# Altium schematic sheet power.SchDoc
size A4
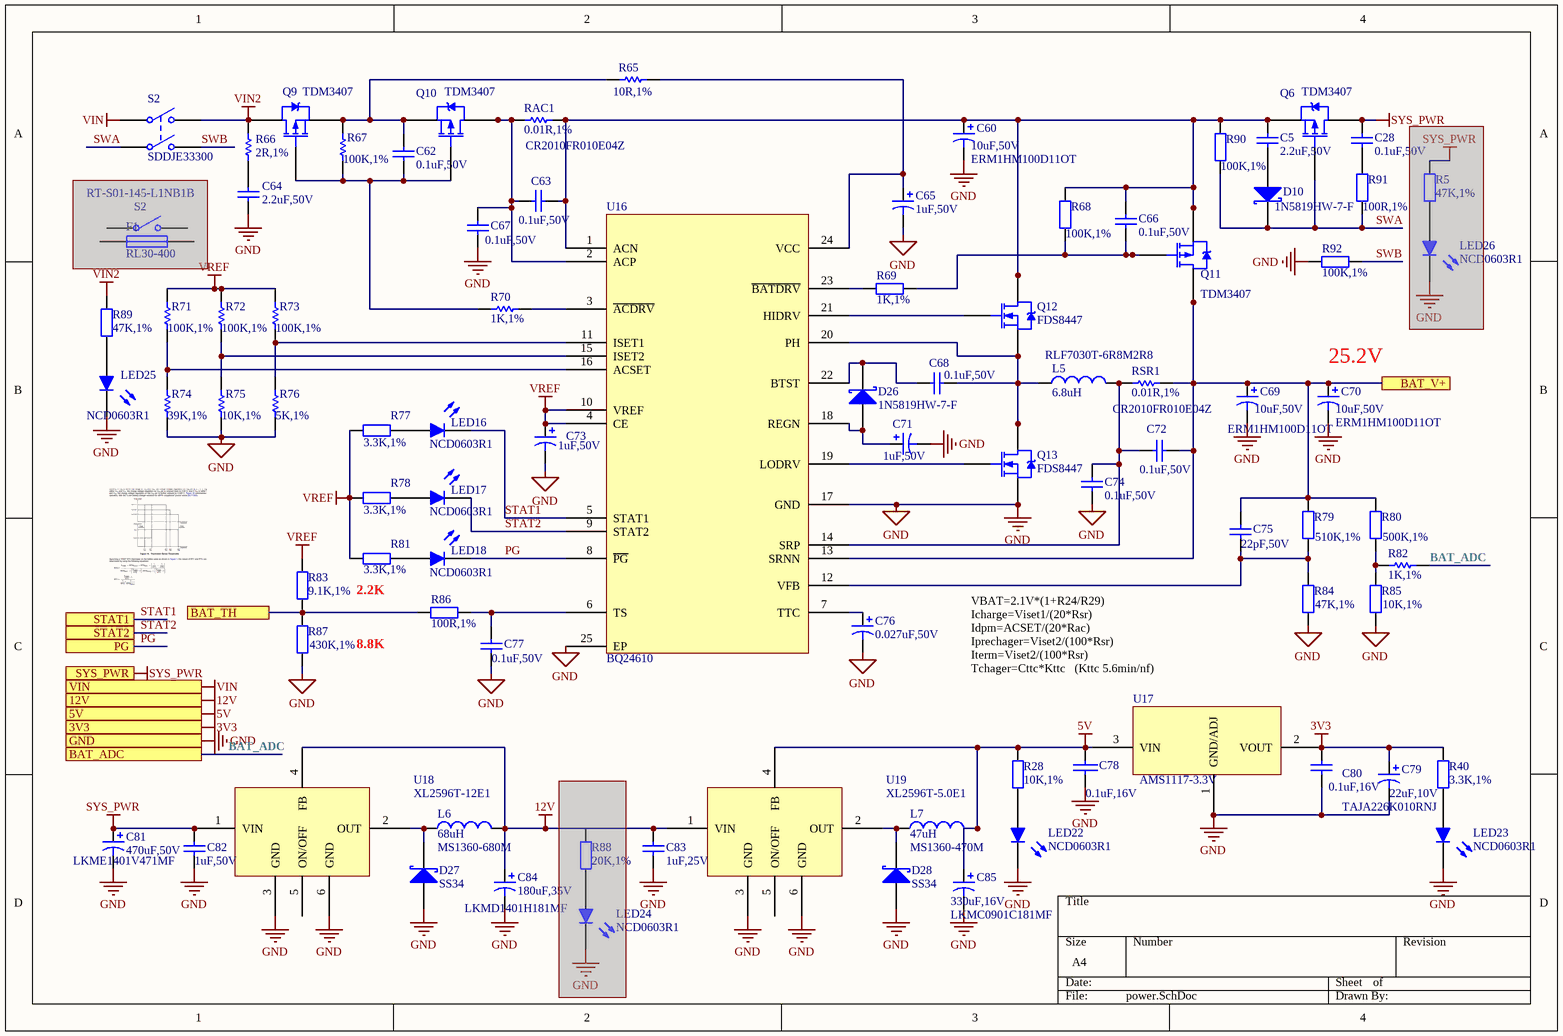
[diagram p0: power.SchDoc]

## Parts
(Parts that share a designator on the sheet are numbered #1, #2 ... from top to bottom, then left to right.)
C5  2.2uF,50V  [C0805]
C28  0.1uF,50V  [C0603]
C60  10uF,50V  value ERM1HM100D11OT  [CAP-TH_BD5.0-P2.00-D0.8-FD]
C62  0.1uF,50V  [C0603]
C63  0.1uF,50V  [C0603]
C64  2.2uF,50V  [C1206]
C65  1uF,50V  [C0603]
C66  0.1uF,50V  [C0603]
C67  0.1uF,50V  [C0603]
C68  0.1uF,50V  [C0603]
C69  10uF,50V  value ERM1HM100D11OT  [CAP-TH_BD5.0-P2.00-D0.8-FD]
C70  10uF,50V  value ERM1HM100D11OT  [CAP-TH_BD5.0-P2.00-D0.8-FD]
C71  1uF,50V  [C0603]
C72  0.1uF,50V  [C0603]
C73  1uF,50V  [C0603]
C74  0.1uF,50V  [C0603]
C75  22pF,50V  [C0603]
C76  0.027uF,50V  [C0603]
C77  0.1uF,50V  [C0603]
C78  0.1uF,16V  [C0603]
C79  22uF,10V  value TAJA226K010RNJ  [CAP-SMD_L3.2-W1.6-R-RD]
C80  0.1uF,16V  [C0603]
C81  470uF,50V  value LKME1401V471MF  [CAP-TH_BD10.0-P5.00-D1.0-FD]
C82  1uF,50V  [C0603]
C83  1uF,25V  [C0603]
C84  180uF,35V  value LKMD1401H181MF  [CAP-TH_BD8.0-P3.50-D1.0-FD]
C85  330uF,16V  value LKMC0901C181MF  [CAP-TH_BD6.3-P2.50-D1.0-FD]
D10  1N5819HW-7-F  [SOD-123_L2.8-W1.8-LS3.7-FD]
D26  1N5819HW-7-F  [SOD-123_L2.8-W1.8-LS3.7-FD]
D27  SS34  [SMB_L4.6-W3.6-LS5.3-RD]
D28  SS34  [SMB_L4.6-W3.6-LS5.3-RD]
F1  RL30-400  [FUSE-TH_L14.0-W3.0-P5.08-D1.2-S1.2]  (masked out: inside a compile mask, not in the netlist)
L5  6.8uH  value RLF7030T-6R8M2R8  [IND-SMD_L7.3-W6.8]
L6  68uH  value MS1360-680M  [IND-SMD_L13.7-W12.6_MS1360]
L7  47uH  value MS1360-470M  [IND-SMD_L13.7-W12.6_MS1360]
LED16  NCD0603R1  [LED0603-RD]
LED17  NCD0603R1  [LED0603-RD]
LED18  NCD0603R1  [LED0603-RD]
LED22  NCD0603R1  [LED0603-RD]
LED23  NCD0603R1  [LED0603-RD]
LED24  NCD0603R1  [LED0603-RD]  (masked out: inside a compile mask, not in the netlist)
LED25  NCD0603R1  [LED0603-RD]
LED26  NCD0603R1  [LED0603-RD]  (masked out: inside a compile mask, not in the netlist)
Q6  TDM3407  [SO8_L]
Q9  TDM3407  [SO8_L]
Q10  TDM3407  [SO8_L]
Q11  TDM3407  [SO8_L]
Q12  FDS8447  [SO8_L]
Q13  FDS8447  [SO8_L]
R5  47K,1%  [R0603]  (masked out: inside a compile mask, not in the netlist)
R28  10K,1%  [R0603]
R40  3.3K,1%  [R0603]
R65  10R,1%  [R1210]
R66  2R,1%  [R2512]
R67  100K,1%  [R0603]
R68  100K,1%  [R0603]
R69  1K,1%  [R0603]
R70  1K,1%  [R0603]
R71  100K,1%  [R0603]
R72  100K,1%  [R0603]
R73  100K,1%  [R0603]
R74  39K,1%  [R0603]
R75  10K,1%  [R0603]
R76  5K,1%  [R0603]
R77  3.3K,1%  [R0603]
R78  3.3K,1%  [R0603]
R79  510K,1%  [R0603]
R80  500K,1%  [R0603]
R81  3.3K,1%  [R0603]
R82  1K,1%  [R0603]
R83  9.1K,1%  [R0603]
R84  47K,1%  [R0603]
R85  10K,1%  [R0603]
R86  100R,1%  [R0603]
R87  430K,1%  [R0603]
R88  20K,1%  [R0603]  (masked out: inside a compile mask, not in the netlist)
R89  47K,1%  [R0603]
R90  100K,1%  [R0603]
R91  100R,1%  [R0603]
R92  100K,1%  [R0603]
RAC1  0.01R,1%  value CR2010FR010E04Z  [R2010]
RSR1  0.01R,1%  value CR2010FR010E04Z  [R2010]
S2#1  SDDJE33300  [SW-TH_SDDJE33300]
S2#2  RT-S01-145-L1NB1B  [SW-TH_RT-S01-145-L1NB1B]  (masked out: inside a compile mask, not in the netlist)
U16  BQ24610  [QFN-24_L4.0-W4.0-P0.50-TL-EP2.7]
U17  AMS1117-3.3V  [ams1117/SOT223]
U18  XL2596T-12E1  [TO-263-5_L10.6-W9.6-P1.70-LS15.9-TL]
U19  XL2596T-5.0E1  [TO-263-5_L10.6-W9.6-P1.70-LS15.9-TL]

## Ports
3V3, 5V, 12V, BAT_ADC, BAT_TH, BAT_V+, GND, PG, STAT1, STAT2, SYS_PWR, VIN

## Nets
3V3: C79.1 C80.2 R40.2 U17.2(VOUT) ; port 3V3
5V: C78.2 C85.1 L7.2 R28.2 U17.3(VIN) U19.4(FB) ; port 5V
12V: C83.1 C84.1 L6.2 U18.4(FB) U19.1(VIN) ; port 12V
GND: C60.2 C64.1 C65.2 C67.2 C69.2 C70.2 C71.2 C73.2 C74.1 C76.2 C77.2 C78.1 C79.2 C80.1 C81.2 C82.2 C83.2 C84.2 C85.2 D27.1(A) D28.1(A) LED22.1(K) LED23.1(K) LED25.1(K) Q13.1(S) Q13.2(S) Q13.3(S) R74.2 R75.2 R76.2 R84.1 R85.1 R87.2 R92.2 U16.17(GND) U16.25(EP) U17.1(GND/ADJ) U18.3(GND) U18.6(GND) U19.3(GND) U19.6(GND) ; port GND
SYS_PWR: C28.2 C81.1 C82.1 Q6.5(D) Q6.6(D) Q6.7(D) Q6.8(D) U18.1(VIN) ; port SYS_PWR
VIN: S2#1.1(COMMON1) ; port VIN
VIN2: Q9.5(D) Q9.6(D) Q9.7(D) Q9.8(D) R66.2 R89.2 S2#1.2(NO1)
VREF: C73.1 R71.1 R72.1 R73.1 R77.1 R78.1 R81.1 R83.1 U16.4(CE) U16.10(VREF)
BAT_ADC: R82.1 ; port BAT_ADC
BAT_TH: R83.2 R86.1 R87.1 ; port BAT_TH
BAT_V+: C69.1 C70.1 C72.1 C75.1 Q11.5(D) Q11.6(D) Q11.7(D) Q11.8(D) R79.2 R80.2 RSR1.2 U16.13(SRNN) ; port BAT_V+
PG: LED18.1(K) U16.8(~{PG}) ; port PG
STAT1: LED16.1(K) U16.5(STAT1) ; port STAT1
STAT2: LED17.1(K) U16.9(STAT2) ; port STAT2
SWA: D10.2(K) Q6.4(G) R90.2 R91.2 S2#1.3(COMMON2)
SWB: R92.1 S2#1.4(NO2)
NetC5_1: C5.1 D10.1(A)
NetC5_2: C5.2 C60.1 C63.1 C66.2 Q6.1(S) Q6.2(S) Q6.3(S) Q11.1(S) Q11.2(S) Q11.3(S) Q12.5(D) Q12.6(D) Q12.7(D) Q12.8(D) R68.1 R90.1 RAC1.2 U16.1(ACN)
NetC28_1: C28.1 R91.1
NetC62_1: C62.1 Q9.4(G) Q10.4(G) R67.1 R70.2
NetC62_2: C62.2 Q9.1(S) Q9.2(S) Q9.3(S) Q10.1(S) Q10.2(S) Q10.3(S) R65.1 R67.2
NetC63_2: C63.2 C67.1 Q10.5(D) Q10.6(D) Q10.7(D) Q10.8(D) RAC1.1 U16.2(ACP)
NetC64_2: C64.2 R66.1
NetC65_1: C65.1 R65.2 U16.24(VCC)
NetC66_1: C66.1 Q11.4(G) R68.2 R69.1
NetC68_1: C68.1 L5.1 Q12.1(S) Q12.2(S) Q12.3(S) Q13.5(D) Q13.6(D) Q13.7(D) Q13.8(D) U16.20(PH)
NetC68_2: C68.2 D26.2(K) U16.22(BTST)
NetC71_1: C71.1 D26.1(A) U16.18(REGN)
NetC72_2: C72.2 C74.2 L5.2 RSR1.1 U16.14(SRP)
NetC75_2: C75.2 R79.1 R84.2 U16.12(VFB)
NetC76_1: C76.1 U16.7(TTC)
NetC77_1: C77.1 R86.2 U16.6(TS)
NetD27_2: D27.2(K) L6.1 U18.2(OUT)
NetD28_2: D28.2(K) L7.1 U19.2(OUT)
NetLED16_2: LED16.2(A) R77.2
NetLED17_2: LED17.2(A) R78.2
NetLED18_2: LED18.2(A) R81.2
NetLED22_2: LED22.2(A) R28.1
NetLED23_2: LED23.2(A) R40.1
NetLED25_2: LED25.2(A) R89.1
NetQ12_4: Q12.4(G) U16.21(HIDRV)
NetQ13_4: Q13.4(G) U16.19(LODRV)
NetR69_2: R69.2 U16.23(~{BATDRV})
NetR70_1: R70.1 U16.3(~{ACDRV})
NetR71_2: R71.2 R74.1 U16.16(ACSET)
NetR72_2: R72.2 R75.1 U16.15(ISET2)
NetR73_2: R73.2 R76.1 U16.11(ISET1)
NetR80_1: R80.1 R82.2 R85.2

Not connected (* = marked no-connect by the designer): U18 5(ON/OFF); U19 5(ON/OFF)

## Notes on the sheet
- (near C70) 25.2V
- (near R81) 2.2K
- 8.8K
- VBAT=2.1V*(1+R24/R29)
  Icharge=Viset1/(20*Rsr)
  Idpm=ACSET/(20*Rac)
  Iprechager=Viset2/(100*Rsr)
  Iterm=Viset2/(100*Rsr)
  Tchager=Cttc*Kttc   (Kttc 5.6min/nf)

## Library data of the parts
C5 C28 C66 C68 C74 = Cap: Capacitor; Value: 0.1uF, 50V, 10%, X7R; Published: 8-Jun-2000; LatestRevisionDate: 17-Jul-2002; LatestRevisionNote: Re-released for DXP Platform.; PackageReference: RAD-0.3; Publisher: Altium Limited; PackageDescription: Radial Cap, Thru-Hole; 2 Leads; 0.3 in Pin Spacing
C60 C69 C70 = Cap Pol1: Polarized Capacitor (Radial); Published: 8-Jun-2000; LatestRevisionDate: 17-Jul-2002; LatestRevisionNote: Re-released for DXP Platform.; PackageReference: RB7.6-15; Publisher: Altium Limited; PackageDescription: Polarized Capacitor (Radial); 2 Leads
C62 = Cap: 50V，10%，X7R; Value: 0.1uF, 50V, 10%, X7R; Published: 8-Jun-2000; LatestRevisionDate: 17-Jul-2002; LatestRevisionNote: Re-released for DXP Platform.; PackageReference: RAD-0.3; Publisher: Altium Limited; PackageDescription: Radial Cap, Thru-Hole; 2 Leads; 0.3 in Pin Spacing
C63 = Cap: 16V，10%，X7R; Published: 8-Jun-2000; LatestRevisionDate: 17-Jul-2002; LatestRevisionNote: Re-released for DXP Platform.; PackageReference: RAD-0.3; Publisher: Altium Limited; PackageDescription: Radial Cap, Thru-Hole; 2 Leads; 0.3 in Pin Spacing; Value: 0.1uF
C64 = Cap: Capacitor; Value: 2.2uF, 35V, 10%, X7R; Published: 8-Jun-2000; LatestRevisionDate: 17-Jul-2002; LatestRevisionNote: Re-released for DXP Platform.; PackageReference: RAD-0.3; Publisher: Altium Limited; PackageDescription: Radial Cap, Thru-Hole; 2 Leads; 0.3 in Pin Spacing
C65 = Cap Pol1: 50V，10%，X7R; Value: 1uF, 50V, 10%, X7R; Published: 8-Jun-2000; LatestRevisionDate: 17-Jul-2002; LatestRevisionNote: Re-released for DXP Platform.; PackageReference: RB7.6-15; Publisher: Altium Limited; PackageDescription: Polarized Capacitor (Radial); 2 Leads
C67 = Cap: 50V, 10%, X7R; Value: 0.1uF, 50V, 10%, X7R; Published: 8-Jun-2000; LatestRevisionDate: 17-Jul-2002; LatestRevisionNote: Re-released for DXP Platform.; PackageReference: RAD-0.3; Publisher: Altium Limited; PackageDescription: Radial Cap, Thru-Hole; 2 Leads; 0.3 in Pin Spacing
C71 C73 = Cap Pol1: Polarized Capacitor (Radial); Value: 1uF, 16V, 10%, X7R; Published: 8-Jun-2000; LatestRevisionDate: 17-Jul-2002; LatestRevisionNote: Re-released for DXP Platform.; PackageReference: RB7.6-15; Publisher: Altium Limited; PackageDescription: Polarized Capacitor (Radial); 2 Leads
C72 C77 = Cap: Capacitor; Value: 0.1uF, 16V, 10%, X7R; Published: 8-Jun-2000; LatestRevisionDate: 17-Jul-2002; LatestRevisionNote: Re-released for DXP Platform.; PackageReference: RAD-0.3; Publisher: Altium Limited; PackageDescription: Radial Cap, Thru-Hole; 2 Leads; 0.3 in Pin Spacing
C75 = Cap: Capacitor; Value: 22pF, 25V, 10%, X7R; Published: 8-Jun-2000; LatestRevisionDate: 17-Jul-2002; LatestRevisionNote: Re-released for DXP Platform.; PackageReference: RAD-0.3; Publisher: Altium Limited; PackageDescription: Radial Cap, Thru-Hole; 2 Leads; 0.3 in Pin Spacing
C76 = Cap Pol1: Polarized Capacitor (Radial); Value: 0.027uF, 16V, 5%, X7R; Published: 8-Jun-2000; LatestRevisionDate: 17-Jul-2002; LatestRevisionNote: Re-released for DXP Platform.; PackageReference: RB7.6-15; Publisher: Altium Limited; PackageDescription: Polarized Capacitor (Radial); 2 Leads
C78 = CAP: Capacitor; Type: 贴片电容; Value: 104,16V
C79 = 有极电容: 钽电容
C80 = 无极电容: Value: 104, 50V; Type: 贴片电容; Value: 000001
C81 C84 C85 = 有极电容
C82 C83 = CAP: Capacitor; Fitted: True
D10 D26-D28 = D Schottky: Schottky Diode
  D10 D26: Published: 8-Jun-2000; LatestRevisionDate: 17-Jul-2002; LatestRevisionNote: Re-released for DXP Platform.; PackageReference: SMB; Publisher: Altium Limited; PackageDescription: DO-214-AA/SMB; 2 C-Bend Leads; Body 5.3 x 3.6 mm, inc. leads (LxW); Code_JEDEC: DO-214-AA
F1 = Fuse 1: Fuse; Published: 8-Jun-2000; LatestRevisionDate: 17-Jul-2002; LatestRevisionNote: Re-released for DXP Platform.; PackageReference: PIN-W2/E2.8; Publisher: Altium Limited; PackageDescription: Thru-Hole; 2 Leads
L5-L7 = Inductor: Code_IEC: 1005; Published: 8-Jun-2000; LatestRevisionDate: 29-May-2009; LatestRevisionNote: IPC-7351 Footprint Added.; PackageReference: 0402-A; Publisher: Altium Limited; PackageDescription: Chip Inductor; Code_JEITA: 0402
LED16-LED18 LED22-LED26 = LED0603: Typical INFRARED GaAs LED
Q6 Q9-Q11 = TDM3407: P-Channel Power MOSFET
Q12 Q13 = FDS8447: N-Channel Power MOSFET; ComponentLink1Description: Manufacturer Link; ComponentLink1URL: http://www.irf.com/
R5 R28 R40 R86 R88 R89 = Res2: 精度5%; Value: 101, 精度5%; Published: 8-Jun-2000; LatestRevisionDate: 17-Jul-2002; LatestRevisionNote: Re-released for DXP Platform.; PackageReference: AXIAL-0.4; Publisher: Altium Limited; PackageDescription: Axial Device, Thru-Hole; 2 Leads; 0.4 in Pin Spacing
R65 = Res1: 精度5%; Value: 10欧, 精度5%; Published: 8-Jun-2000; LatestRevisionDate: 17-Jul-2002; LatestRevisionNote: Re-released for DXP Platform.; PackageReference: AXIAL-0.3; Publisher: Altium Limited; PackageDescription: Axial Device, Thru-Hole; 2 Leads; 0.3 in Pin Spacing
R66 = Res1: 精度5%; Value: 2; Published: 8-Jun-2000; LatestRevisionDate: 17-Jul-2002; LatestRevisionNote: Re-released for DXP Platform.; PackageReference: AXIAL-0.3; Publisher: Altium Limited; PackageDescription: Axial Device, Thru-Hole; 2 Leads; 0.3 in Pin Spacing
R67 = Res1: 精度5%; Value: 100K, 精度5%; Published: 8-Jun-2000; LatestRevisionDate: 17-Jul-2002; LatestRevisionNote: Re-released for DXP Platform.; PackageReference: AXIAL-0.3; Publisher: Altium Limited; PackageDescription: Axial Device, Thru-Hole; 2 Leads; 0.3 in Pin Spacing
R68 R90-R92 = Res2: 精度5%; Value: 100K, 精度5%; Published: 8-Jun-2000; LatestRevisionDate: 17-Jul-2002; LatestRevisionNote: Re-released for DXP Platform.; PackageReference: AXIAL-0.4; Publisher: Altium Limited; PackageDescription: Axial Device, Thru-Hole; 2 Leads; 0.4 in Pin Spacing
R69 = Res2: 精度5%; Value: 1K, 精度5%; Published: 8-Jun-2000; LatestRevisionDate: 17-Jul-2002; LatestRevisionNote: Re-released for DXP Platform.; PackageReference: AXIAL-0.4; Publisher: Altium Limited; PackageDescription: Axial Device, Thru-Hole; 2 Leads; 0.4 in Pin Spacing
R70 R82 = Res1: 精度5%; Value: 1K, 精度5%; Published: 8-Jun-2000; LatestRevisionDate: 17-Jul-2002; LatestRevisionNote: Re-released for DXP Platform.; PackageReference: AXIAL-0.3; Publisher: Altium Limited; PackageDescription: Axial Device, Thru-Hole; 2 Leads; 0.3 in Pin Spacing
R71 = Res1: 精度0.5%; Value: 100K, 精度0.5%; Published: 8-Jun-2000; LatestRevisionDate: 17-Jul-2002; LatestRevisionNote: Re-released for DXP Platform.; PackageReference: AXIAL-0.3; Publisher: Altium Limited; PackageDescription: Axial Device, Thru-Hole; 2 Leads; 0.3 in Pin Spacing
R72 R73 = Res1: 精度0.5%; Published: 8-Jun-2000; LatestRevisionDate: 17-Jul-2002; LatestRevisionNote: Re-released for DXP Platform.; PackageReference: AXIAL-0.3; Publisher: Altium Limited; PackageDescription: Axial Device, Thru-Hole; 2 Leads; 0.3 in Pin Spacing; Value: 100K
R74 = Res1: 精度0.5%; Value: 39K, 精度0.5%; Published: 8-Jun-2000; LatestRevisionDate: 17-Jul-2002; LatestRevisionNote: Re-released for DXP Platform.; PackageReference: AXIAL-0.3; Publisher: Altium Limited; PackageDescription: Axial Device, Thru-Hole; 2 Leads; 0.3 in Pin Spacing
R75 = Res1: 精度0.5%; Value: 10K, 精度0.5%; Published: 8-Jun-2000; LatestRevisionDate: 17-Jul-2002; LatestRevisionNote: Re-released for DXP Platform.; PackageReference: AXIAL-0.3; Publisher: Altium Limited; PackageDescription: Axial Device, Thru-Hole; 2 Leads; 0.3 in Pin Spacing
R76 = Res1: 精度0.5%; Value: 19.1K, 精度0.5%; Published: 8-Jun-2000; LatestRevisionDate: 17-Jul-2002; LatestRevisionNote: Re-released for DXP Platform.; PackageReference: AXIAL-0.3; Publisher: Altium Limited; PackageDescription: Axial Device, Thru-Hole; 2 Leads; 0.3 in Pin Spacing
R77 = Res2: 精度5%; Value: 10K, 精度5%; Published: 8-Jun-2000; LatestRevisionDate: 17-Jul-2002; LatestRevisionNote: Re-released for DXP Platform.; PackageReference: AXIAL-0.4; Publisher: Altium Limited; PackageDescription: Axial Device, Thru-Hole; 2 Leads; 0.4 in Pin Spacing
R78 R81 = Res2: 精度5%; Value: 10K; Published: 8-Jun-2000; LatestRevisionDate: 17-Jul-2002; LatestRevisionNote: Re-released for DXP Platform.; PackageReference: AXIAL-0.4; Publisher: Altium Limited; PackageDescription: Axial Device, Thru-Hole; 2 Leads; 0.4 in Pin Spacing
R79 R80 = Res2: 精度0.5%; Value: 684, 精度0.5%; Published: 8-Jun-2000; LatestRevisionDate: 17-Jul-2002; LatestRevisionNote: Re-released for DXP Platform.; PackageReference: AXIAL-0.4; Publisher: Altium Limited; PackageDescription: Axial Device, Thru-Hole; 2 Leads; 0.4 in Pin Spacing
R83 = Res2: 精度1%; Value: 912, 精度1%; Published: 8-Jun-2000; LatestRevisionDate: 17-Jul-2002; LatestRevisionNote: Re-released for DXP Platform.; PackageReference: AXIAL-0.4; Publisher: Altium Limited; PackageDescription: Axial Device, Thru-Hole; 2 Leads; 0.4 in Pin Spacing
R84 R85 = Res2: 精度0.5%; Value: 01D, 精度0.5%; Published: 8-Jun-2000; LatestRevisionDate: 17-Jul-2002; LatestRevisionNote: Re-released for DXP Platform.; PackageReference: AXIAL-0.4; Publisher: Altium Limited; PackageDescription: Axial Device, Thru-Hole; 2 Leads; 0.4 in Pin Spacing
R87 = Res2: 精度1%; Value: 434, 精度1%; Published: 8-Jun-2000; LatestRevisionDate: 17-Jul-2002; LatestRevisionNote: Re-released for DXP Platform.; PackageReference: AXIAL-0.4; Publisher: Altium Limited; PackageDescription: Axial Device, Thru-Hole; 2 Leads; 0.4 in Pin Spacing
RAC1 RSR1 = Res1: Resistor; Published: 8-Jun-2000; LatestRevisionDate: 17-Jul-2002; LatestRevisionNote: Re-released for DXP Platform.; PackageReference: AXIAL-0.3; Publisher: Altium Limited; PackageDescription: Axial Device, Thru-Hole; 2 Leads; 0.3 in Pin Spacing
S2#1 = SW-DPST: Double-Pole, Single-Throw Switch; Published: 24-Mar-1999; LatestRevisionDate: 17-Jul-2002; LatestRevisionNote: Re-released for DXP Platform.; PackageReference: DPST-4; Publisher: Altium Limited; PackageDescription: Switch; 4 Leads
S2#2 = SW-SPST: Single-Pole, Single-Throw Switch; Published: 24-Mar-1999; LatestRevisionDate: 17-Jul-2002; LatestRevisionNote: Re-released for DXP Platform.; PackageReference: SPST-2; Publisher: Altium Limited; PackageDescription: Switch; 2 Leads
U16 = BQ24616: TI电源管理IC；
U17 = ams1117: Type: 集成模块
U18 U19 = XL2596S: 3A 150KHz 40V Buck DC to DC Converter